# Altium schematic sheet Sheet2.SCHDOC
size 431 x 279 mm; SheetNumber: 0; SheetTotal: 0
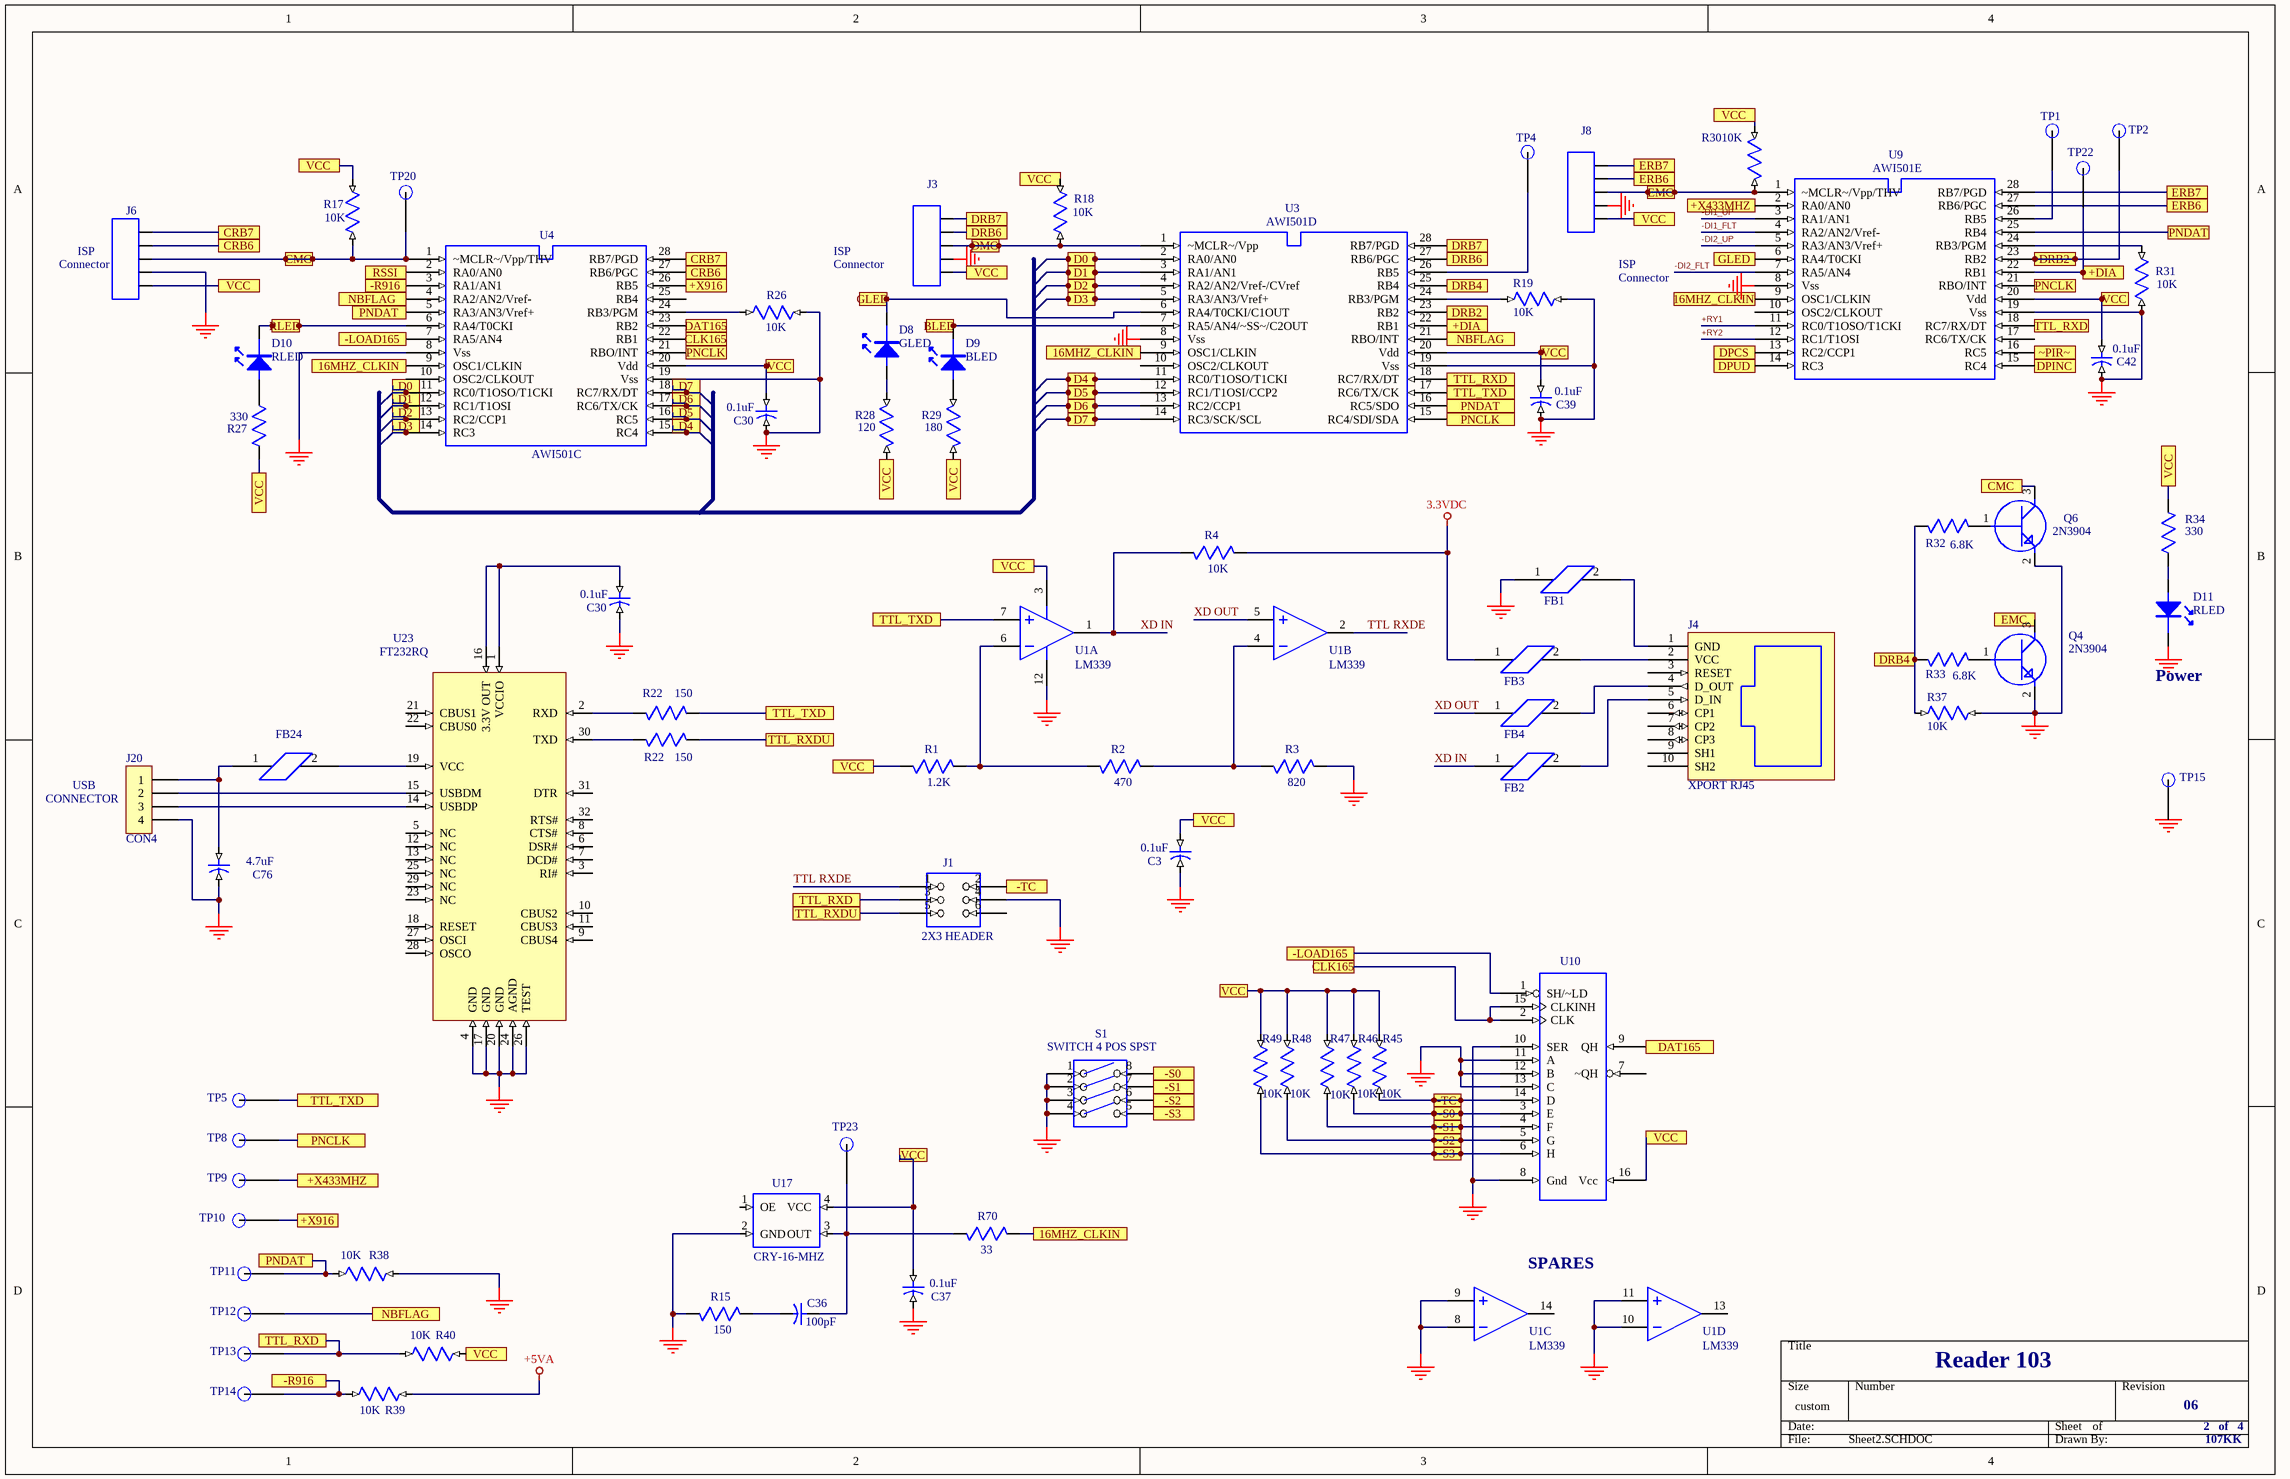
[diagram p0: Sheet2.SCHDOC]

## Parts
(Parts that share a designator on the sheet are numbered #1, #2 ... from top to bottom, then left to right.)
C3  0.1uF  [0603]
C30#1  0.1uF  [0603]
C30#2  0.1uF  [0603]
C36  100pF  [0603]
C37  0.1uF  [0603]
C39  0.1uF  [0603]
C42  0.1uF  [0603]
C76  4.7uF  [0603]
D8  GLED  [LED TH]
D9  BLED  [LED TH]
D10  RLED  [LED TH]
D11  RLED  [LED TH]
FB1  FB  [0603]  (value not drawn)
FB2  FB  [0603]  (value not drawn)
FB3  FB  [0603]  (value not drawn)
FB4  FB  [0603]  (value not drawn)
FB24  FB  [0603]  (value not drawn)
J1  2X3 HEADER  [2X3 HEADER]
J3  HDR5  [1X5 HEADER]  (value not drawn)
J4  XPORT RJ45  [CONN XPORT]
J6  HDR5  [1X5 HEADER]  (value not drawn)
J8  1X5 HEADER  [1X5 HEADER]  (value not drawn)
J20  CON4  [USB JACK]
Q4  2N3904  [SOT23 TRANS]
Q6  2N3904  [SOT23 TRANS]
R1  1.2K  [0603]
R2  470  [0603]
R3  820  [0603]
R4  10K  [0603]
R15  150  [0603]
R17  10K  [0603]
R18  10K  [0603]
R19  10K  [0603]
R22#1  150  [0603]
R22#2  150  [0603]
R26  10K  [0603]
R27  330  [0603]
R28  120  [0603]
R29  180  [0603]
R30  10K  [0603]
R31  10K  [0603]
R32  6.8K  [0603]
R33  6.8K  [0603]
R34  330  [0603]
R37  10K  [0603]
R38  10K  [0603]
R39  10K  [0603]
R40  10K  [0603]
R45  10K  [0603]
R46  10K  [0603]
R47  10K  [0603]
R48  10K  [0603]
R49  10K  [0603]
R70  33  [0603]
S1  SWITCH 4 POS SPST  [SWITCH 4 POS SPST]
TP1  TP  [TESTPOINT-1]  (value not drawn)
TP2  TP  [TESTPOINT-1]  (value not drawn)
TP4  TP  [TESTPOINT-1]  (value not drawn)
TP5  TP  [TESTPOINT-1]  (value not drawn)
TP8  TP  [TESTPOINT-1]  (value not drawn)
TP9  TP  [TESTPOINT-1]  (value not drawn)
TP10  TP  [TESTPOINT-1]  (value not drawn)
TP11  TP  [TESTPOINT-1]  (value not drawn)
TP12  TP  [TESTPOINT-1]  (value not drawn)
TP13  TP  [TESTPOINT-1]  (value not drawn)
TP14  TP  [TESTPOINT-1]  (value not drawn)
TP15  TP  [TESTPOINT-1]  (value not drawn)
TP20  TP  [TESTPOINT-1]  (value not drawn)
TP22  TP  [TESTPOINT-1]  (value not drawn)
TP23  TP  [TESTPOINT-1]  (value not drawn)
U1  LM339  [SO14]  (parts A,B,C,D of 4)
U3  AWI501D  [SSOP-28]
U4  AWI501C  [PIC16F870]
U9  AWI501E  [PIC16F870]
U10  74165  [SO16]  (value not drawn)
U17  CRY-16-MHZ  [CRY-SMD-5-7]
U23  FT232RQ  [QFN32]

## Ports
16MHZ_CLKIN, +DIA, +X433MHZ, +X916, -LOAD165, -R916, -S0, -S1, -S2, -S3, -TC, BLED, CLK165, CMC, CRB6, CRB7, D0, D1, D2, D3, D4, D5, D6, D7, DAT165, DMC, DPCS, DPINC, DPUD, DRB2, DRB4, DRB6, DRB7, EMC, ERB6, ERB7, GLED, NBFLAG, PNCLK, PNDAT, RLED, RSSI, TTL_RXD, TTL_RXDU, TTL_TXD, VCC, ~PIR~

## Nets
3.3VDC: FB3.1 R4.1(A)
+5VA: R39.1(A)
GND_COM: C3.2(B) C30#1.2(B) C30#2.2(B) C37.2(B) C39.2(B) C42.2(B) C76.2(B) D11.K FB1.1 J1.4 J3.4 J6.4 J8.4 J20.4 Q4.2 Q6.2 R3.1(A) R15.2(B) R19.1(A) R26.2(B) R31.2(B) R37.2(B) R38.1(A) S1.1 S1.2 S1.3 S1.4 TP15.1(TP) U1.8 U1.9 U1.10 U1.11 U1.12 U3.8(Vss) U3.19(Vss) U4.8(Vss) U4.19(Vss) U9.8(Vss) U9.19(Vss) U10.8(Gnd) U10.10(SER) U10.11(A) U10.12(B) U10.13(C) U17.2(GND) U23.4(GND) U23.17(GND) U23.20(GND) U23.24(AGND) U23.26(TEST)
16MHZ_CLKIN: R70.1(A) U3.9(OSC1/CLKIN) U4.9(OSC1/CLKIN) U9.9(OSC1/CLKIN) ; port 16MHZ_CLKIN
+DIA: TP22.1(TP) U3.22(RB1) U9.22(RB1) ; port +DIA
+RY1: U9.11(RC0/T1OSO/T1CKI)
+RY2: U9.12(RC1/T1OSI)
+X433MHZ: TP9.1(TP) U9.2(RA0/AN0) ; port +X433MHZ
+X916: TP10.1(TP) U4.26(RB5) ; port +X916
-DI1_FLT: U9.4(RA2/AN2/Vref-)
-DI1_UP: U9.3(RA1/AN1)
-DI2_FLT: U9.7(RA5/AN4)
-DI2_UP: U9.5(RA3/AN3/Vref+)
-LOAD165: U4.7(RA5/AN4) U10.1(SH/~LD) ; port -LOAD165
-R916: R39.2(B) TP14.1(TP) U4.3(RA1/AN1) ; port -R916
-S0: R46.1(A) S1.8 U10.3(E) ; port -S0
-S1: R47.1(A) S1.7 U10.4(F) ; port -S1
-S2: R48.1(A) S1.6 U10.5(G) ; port -S2
-S3: R49.1(A) S1.5 U10.6(H) ; port -S3
-TC: J1.2 R45.1(A) U10.14(D) ; port -TC
BLED: D9.K U3.7(RA5/AN4/~SS~/C2OUT) ; port BLED
CLK165: U4.22(RB1) U10.2(CLK) U10.15(CLKINH) ; port CLK165
CMC: J6.3 Q6.3 R17.2(B) TP20.1(TP) U4.1(~MCLR~/Vpp/THV) ; port CMC
CRB6: J6.2 U4.27(RB6/PGC) ; port CRB6
CRB7: J6.1 U4.28(RB7/PGD) ; port CRB7
D0: U3.2(RA0/AN0) U4.11(RC0/T1OSO/T1CKI) ; port D0
D1: U3.3(RA1/AN1) U4.12(RC1/T1OSI) ; port D1
D2: U3.4(RA2/AN2/Vref-/CVref) U4.13(RC2/CCP1) ; port D2
D3: U3.5(RA3/AN3/Vref+) U4.14(RC3) ; port D3
D4: U3.11(RC0/T1OSO/T1CKI) U4.15(RC4) ; port D4
D5: U3.12(RC1/T1OSI/CCP2) U4.16(RC5) ; port D5
D6: U3.13(RC2/CCP1) U4.17(RC6/TX/CK) ; port D6
D7: U3.14(RC3/SCK/SCL) U4.18(RC7/RX/DT) ; port D7
DAT165: U4.23(RB2) U10.9(QH) ; port DAT165
DMC: J3.3 R18.2(B) U3.1(~MCLR~/Vpp) ; port DMC
DPCS: U9.13(RC2/CCP1) ; port DPCS
DPINC: U9.15(RC4) ; port DPINC
DPUD: U9.14(RC3) ; port DPUD
DRB2: TP2.1(TP) U3.23(RB2) U9.23(RB2) ; port DRB2
DRB4: R32.1(A) R33.1(A) R37.1(A) U3.25(RB4) ; port DRB4
DRB6: J3.2 U3.27(RB6/PGC) ; port DRB6
DRB7: J3.1 U3.28(RB7/PGD) ; port DRB7
EMC: J8.3 Q4.3 R30.2(B) U9.1(~MCLR~/Vpp/THV) ; port EMC
ERB6: J8.2 U9.27(RB6/PGC) ; port ERB6
ERB7: J8.1 U9.28(RB7/PGD) ; port ERB7
GLED: D8.K U3.6(RA4/T0CKI/C1OUT) U9.6(RA4/T0CKI) ; port GLED
NBFLAG: TP12.1(TP) U3.21(RBO/INT) U4.4(RA2/AN2/Vref-) ; port NBFLAG
PNCLK: TP8.1(TP) U3.15(RC4/SDI/SDA) U4.21(RBO/INT) U9.21(RBO/INT) ; port PNCLK
PNDAT: R38.2(B) TP11.1(TP) U3.16(RC5/SDO) U4.5(RA3/AN3/Vref+) U9.25(RB4) ; port PNDAT
RLED: D10.K U4.6(RA4/T0CKI) ; port RLED
RSSI: U4.2(RA0/AN0) ; port RSSI
TTL RXDE: J1.1 U1.2
TTL_RXD: J1.3 R40.2(B) TP13.1(TP) U3.18(RC7/RX/DT) U9.18(RC7/RX/DT) ; port TTL_RXD
TTL_RXDU: J1.5 R22#2.1(A) ; port TTL_RXDU
TTL_TXD: R22#1.1(A) TP5.1(TP) U1.7 U3.17(RC6/TX/CK) ; port TTL_TXD
VCC: C3.1(A) C30#1.1(A) C37.1(A) C39.1(A) C42.1(A) J3.5 J6.5 J8.5 R1.2(B) R17.1(A) R18.1(A) R27.1(A) R28.1(A) R29.1(A) R30.1(A) R34.2(B) R40.1(A) R45.2(B) R46.2(B) R47.2(B) R48.2(B) R49.2(B) U1.3 U3.20(Vdd) U4.20(Vdd) U9.20(Vdd) U10.16(Vcc) U17.4(VCC) ; port VCC
XD IN: FB2.1 R4.2(B) U1.1
XD OUT: FB4.1 U1.5
~PIR~: U9.16(RC5) ; port ~PIR~
NetC30#2_1: C30#2.1(A) U23.1(VCCIO) U23.16(3.3V_OUT)
NetC36_1: C36.1(A) R70.2(B) TP23.1(TP) U17.3(OUT)
NetC36_2: C36.2(B) R15.1(A)
NetC76_1: C76.1(A) FB24.1 J20.1
NetD8_A: D8.A R28.2(B)
NetD9_A: D9.A R29.2(B)
NetD10_A: D10.A R27.2(B)
NetD11_A: D11.A R34.1(A)
NetFB1_2: FB1.2 J4.1(GND)
NetFB2_2: FB2.2 J4.5(D_IN)
NetFB3_2: FB3.2 J4.2(VCC)
NetFB4_2: FB4.2 J4.4(D_OUT)
NetFB24_2: FB24.2 U23.19(VCC)
NetJ20_2: J20.2 U23.15(USBDM)
NetJ20_3: J20.3 U23.14(USBDP)
NetQ4_1: Q4.1 R33.2(B)
NetQ6_1: Q6.1 R32.2(B)
NetR1_1: R1.1(A) R2.2(B) U1.6
NetR2_1: R2.1(A) R3.2(B) U1.4
NetR19_2: R19.2(B) U3.24(RB3/PGM)
NetR22#1_2: R22#1.2(B) U23.2(RXD)
NetR22#2_2: R22#2.2(B) U23.30(TXD)
NetR26_1: R26.1(A) U4.24(RB3/PGM)
NetR31_1: R31.1(A) U9.24(RB3/PGM)
NetTP1_1: TP1.1(TP) U9.26(RB5)
NetTP4_1: TP4.1(TP) U3.26(RB5)

Not connected (* = marked no-connect by the designer): J1 6; J4 3(RESET) 6(CP1) 7(CP2) 8(CP3) 9(SH1) 10(SH2); U1 13 14; U3 10(OSC2/CLKOUT); U4 10(OSC2/CLKOUT) 25(RB4); U9 10(OSC2/CLKOUT) 17(RC6/TX/CK); U10 7(~QH); U17 1(OE); U23 3(RI#) 5(NC) 6(DSR#) 7(DCD#) 8(CTS#) 9(CBUS4) 10(CBUS2) 11(CBUS3) 12(NC) 13(NC) 18(RESET) 21(CBUS1) 22(CBUS0) 23(NC) 25(NC) 27(OSCI) 28(OSCO) 29(NC) 31(DTR) 32(RTS#)

## Notes on the sheet
- (near J6) Connector
- (near J6) ISP
- ISP
- Connector
- (near D11) Power
- (near J20) CONNECTOR
- USB
- (near U1) SPARES
- Reader 103
- 06
- 2   of   4
- 107KK

## Library data of the parts
C3 C30#1 C30#2 C37 C39 C42 C76 = C_603: Part Field 1: Part Number ECJ-1VF1H104Z; Part Field 2: Vendor Panasonic - ECG; Part Field 3: Description CAP .1UF 50V CERAMIC Y5V 0603
C36 = C_0603: Part Field 1: Part Number ECJ-1VC1H101J; Part Field 2: Vendor Panasonic - ECG; Part Field 3: Description CAP CERAMIC 100PF 50V 0603 SMD
D8-D11 = LED
FB1-FB4 FB24 = FB_0603: Part Field 1: Part Number EXC-ML16A270U; Part Field 2: Vendor Panasonic - ECG; Part Field 3: Description BEAD CORE 27 OHM 4A 0603 SMD
J1 = HDR3X2: Part Field 1: Part Number PTC03DAAN
J4 = XPORT
J8 = HDR5
J20 = CON4: Connector
Q4 Q6 = XSTR_NPN_SOT23: Part Field 1: Part Number FMMT3904TA; Part Field 2: Vendor Zetex Inc.; Part Field 3: Description TRANS GP NPN 40V 200MA SOT-23
R1-R4 R15 R22#1 R22#2 R70 = R_0603: Part Field 1: Part Number 9C06031A1500JLHFT; Part Field 2: Vendor Yageo America; Part Field 3: Description RES 150 OHM 1/16W 5% 0603 SMD
R17-R19 R26 R30 R31 R37-R40 = R_603: Part Field 1: Part Number ERA-V15J103V; Part Field 2: Vendor Panasonic - ECG; Part Field 3: Description RES 10K OHM 1/16W 1500PPM 5%0603
R27 = R_0603: Part Field 1: Part Number ERJ-3GEYJ331V; Part Field 2: Vendor Panasonic - ECG; Part Field 3: Description RES 330 OHM 1/10W 5% 0603 SMD
R28 = R0402: Part Field 1: Part Number ERJ-3GEYJ121V; Part Field 2: Vendor Panasonic - ECG; Part Field 3: Description RES 120 OHM 1/10W 5% 0603 SMD
R29 = R0402: Part Field 1: Part Number ERJ-3GEYJ181V; Part Field 2: Vendor Panasonic - ECG; Part Field 3: Description RES 180 OHM 1/10W 5% 0603 SMD
R32-R34 = R_0603: Part Field 1: Part Number ERJ-3GEYJ682V; Part Field 2: Vendor Panasonic - ECG; Part Field 3: Description RES 6.8K OHM 1/10W 5% 0603 SMD
R45-R49 = R_603: Part Field 1: Part Number ERJ-3GEYJ121V; Part Field 2: Vendor Panasonic - ECG; Part Field 3: Description RES 120 OHM 1/10W 5% 0603 SMD
S1 = SW_4PIN_SMT
TP1 TP2 TP4 TP5 TP8-TP15 TP20 TP22 TP23 = TESTPOINT_1
U1 = OPAMP: Operational Amplifier
U3 = PIC16F876A: Part Field 1: Part Number PIC16F876A-E/SO; Part Field 2: Vendor Microchip Technology; Part Field 3: Description IC MCU FLASH 8KX14 W/AD 28-SOIC
U4 U9 = PIC16F870: Part Field 1: Part Number PIC16F870-E/SO; Part Field 2: Vendor Microchip Technology; Part Field 3: Description IC MCU CMOS 20MHZ 2K FLSH 28SOIC
U10 = 74165-SO-16
U17 = CRY-SMD-5-7
U23 = USB FT232RQ